# EAGLE schematic LCD (EAGLE 6.4)
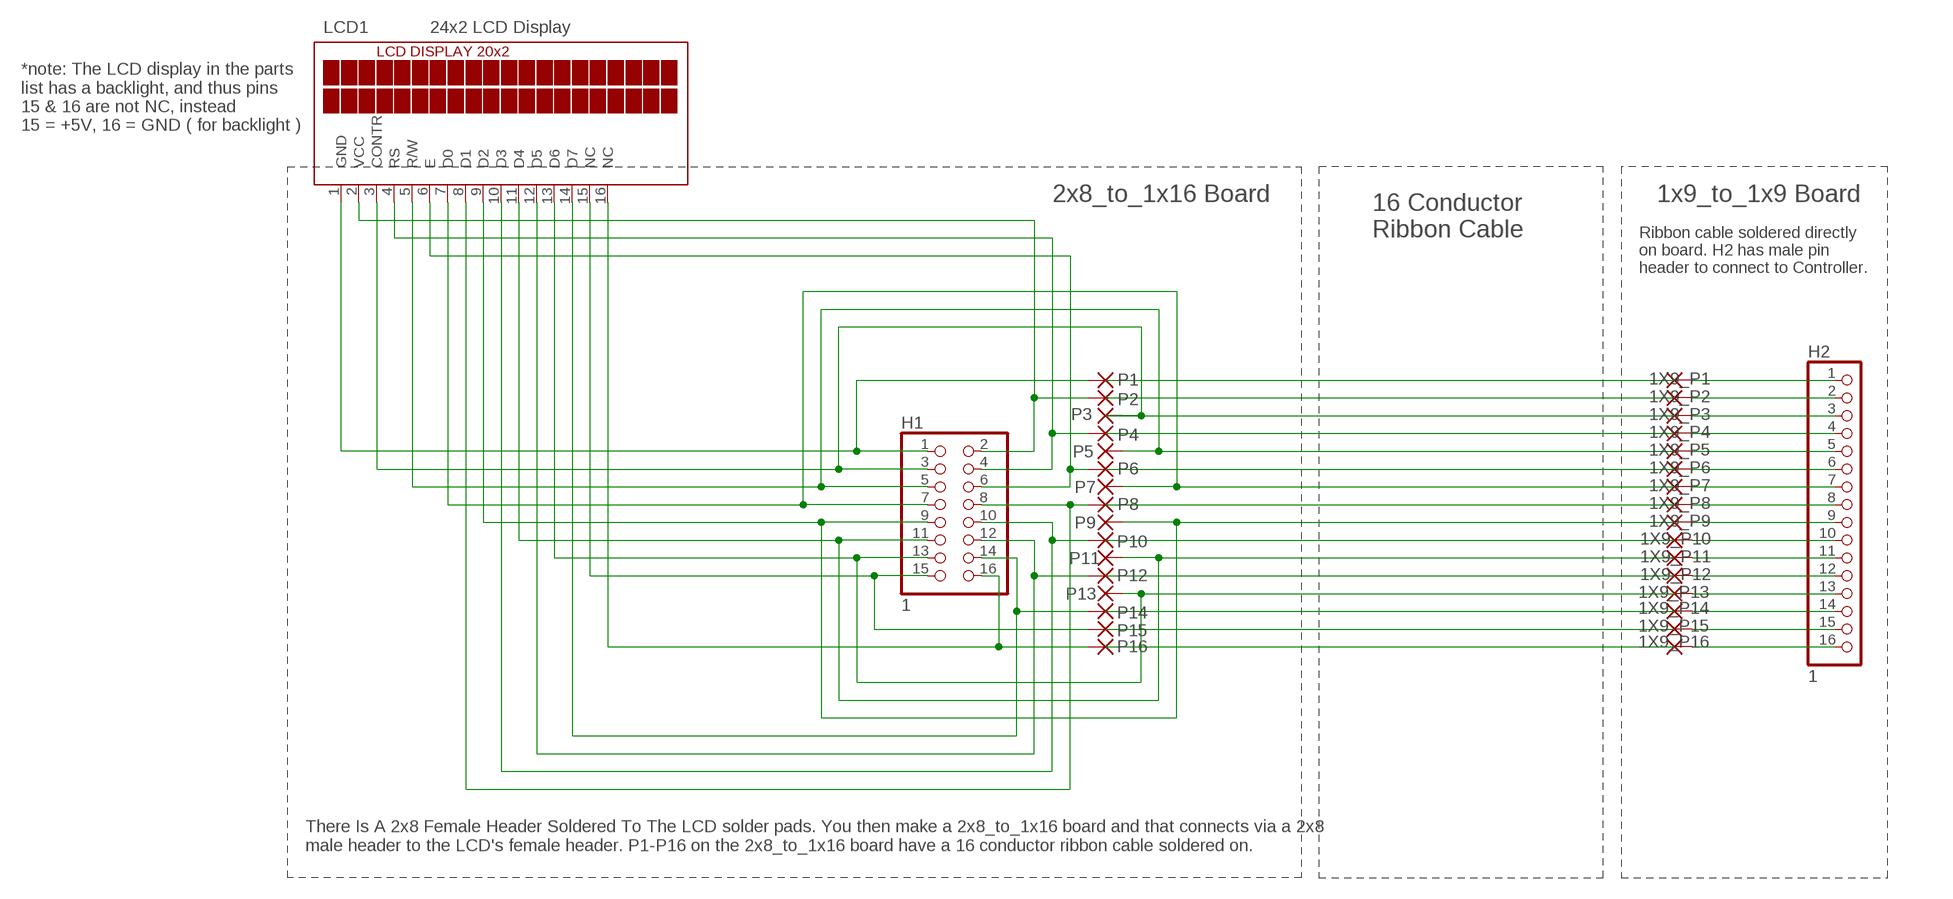
[diagram p0: schematic, sheet 1]

## Parts
1X9_P1  1,6/0,9  [1,6/0,9]
1X9_P2  1,6/0,9  [1,6/0,9]
1X9_P3  1,6/0,9  [1,6/0,9]
1X9_P4  1,6/0,9  [1,6/0,9]
1X9_P5  1,6/0,9  [1,6/0,9]
1X9_P6  1,6/0,9  [1,6/0,9]
1X9_P7  1,6/0,9  [1,6/0,9]
1X9_P8  1,6/0,9  [1,6/0,9]
1X9_P9  1,6/0,9  [1,6/0,9]
1X9_P10  1,6/0,9  [1,6/0,9]
1X9_P11  1,6/0,9  [1,6/0,9]
1X9_P12  1,6/0,9  [1,6/0,9]
1X9_P13  1,6/0,9  [1,6/0,9]
1X9_P14  1,6/0,9  [1,6/0,9]
1X9_P15  1,6/0,9  [1,6/0,9]
1X9_P16  1,6/0,9  [1,6/0,9]
H1  1  PINHD-2X8  [2X08]
H2  1  PINHD-1X16  [1X16]
LCD1  24x2 LCD Display  TUXGR_20X2  [TUXGR_20X2]
P1  1,6/0,9  [1,6/0,9]
P2  1,6/0,9  [1,6/0,9]
P3  1,6/0,9  [1,6/0,9]
P4  1,6/0,9  [1,6/0,9]
P5  1,6/0,9  [1,6/0,9]
P6  1,6/0,9  [1,6/0,9]
P7  1,6/0,9  [1,6/0,9]
P8  1,6/0,9  [1,6/0,9]
P9  1,6/0,9  [1,6/0,9]
P10  1,6/0,9  [1,6/0,9]
P11  1,6/0,9  [1,6/0,9]
P12  1,6/0,9  [1,6/0,9]
P13  1,6/0,9  [1,6/0,9]
P14  1,6/0,9  [1,6/0,9]
P15  1,6/0,9  [1,6/0,9]
P16  1,6/0,9  [1,6/0,9]

## Nets
S$1: H1.1 LCD1.1(GND) P1.1(P)
S$2: 1X9_P1.1(P) H2.1
S$3: H1.3 LCD1.3(CONTR) P3.1(P)
S$4: H1.2 LCD1.2(VCC) P2.1(P)
S$5: H1.5 LCD1.5(R/W) P5.1(P)
S$6: H1.6 LCD1.6(E) P6.1(P)
S$7: H1.7 LCD1.7(D0) P7.1(P)
S$8: 1X9_P2.1(P) H2.2
S$9: H1.9 LCD1.9(D2) P9.1(P)
S$10: 1X9_P3.1(P) H2.3
S$11: H1.11 LCD1.11(D4) P11.1(P)
S$12: 1X9_P4.1(P) H2.4
S$13: H1.13 LCD1.13(D6) P13.1(P)
S$14: 1X9_P5.1(P) H2.5
S$15: H1.15 LCD1.15(NC) P15.1(P)
S$16: 1X9_P6.1(P) H2.6
S$17: 1X9_P7.1(P) H2.7
S$18: H1.4 LCD1.4(RS) P4.1(P)
S$19: 1X9_P8.1(P) H2.8
S$20: H1.8 LCD1.8(D1) P8.1(P)
S$21: H1.12 LCD1.12(D5) P12.1(P)
S$22: H1.10 LCD1.10(D3) P10.1(P)
S$23: H1.14 LCD1.14(D7) P14.1(P)
S$24: H1.16 LCD1.16(NC) P16.1(P)
S$25: 1X9_P9.1(P) H2.9
S$26: 1X9_P10.1(P) H2.10
S$27: 1X9_P11.1(P) H2.11
S$28: 1X9_P12.1(P) H2.12
S$29: 1X9_P13.1(P) H2.13
S$30: 1X9_P14.1(P) H2.14
S$31: 1X9_P15.1(P) H2.15
S$32: 1X9_P16.1(P) H2.16

## Notes on the sheet
- *note: The LCD display in the parts
  list has a backlight, and thus pins
  15 & 16 are not NC, instead
  15 = +5V, 16 = GND ( for backlight )
- 2x8_to_1x16 Board | 1x9_to_1x9 Board
- 16 Conductor
  Ribbon Cable
- Ribbon cable soldered directly
  on board. H2 has male pin
  header to connect to Controller.
- There Is A 2x8 Female Header Soldered To The LCD solder pads. You then make a 2x8_to_1x16 board and that connects via a 2x8
  male header to the LCD's female header. P1-P16 on the 2x8_to_1x16 board have a 16 conductor ribbon cable soldered on.

## Library data of the parts
1X9_P1-1X9_P16 P1-P16 = wirepad:1,6/0,9: THROUGH-HOLE PAD
H1 = pinhead:PINHD-2X8: PIN HEADER
H2 = pinhead:PINHD-1X16: PIN HEADER
LCD1 = display-lcd:TUXGR_20X2: Tuxgraphics LCD display 20x2 characters reflective, without background light Source: tuxgr_20x2.pdf; OC_FARNELL: unknown; OC_NEWARK: unknown